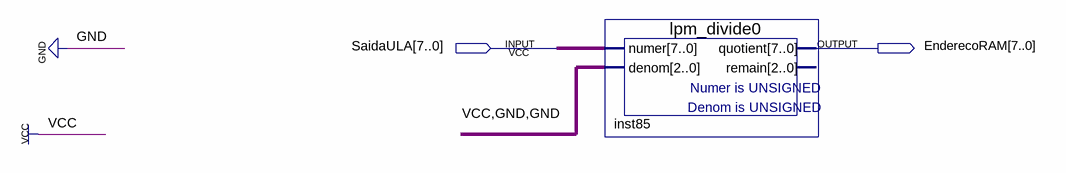
[diagram p0: schematic sheet]
// Quartus schematic DividePor4.bdf as structural Verilog: 1 symbols, 2 pins
module DividePor4 (
  input  [7:0] SaidaULA,
  output [7:0] EnderecoRAM
);

  lpm_divide0 inst85 (.numer(SaidaULA), .denom(3'b100), .quotient(EnderecoRAM));  // open: remain
endmodule
